# Altium schematic sheet MCU.SchDoc: MCU, IO and RF
size A3; DrawnBy: Randipa G. & Alex S. (8); Organization: UC; Address1: ECE Department; Address2: University of Canterbury; Address3: Christchurch 8041; Address4: New Zealand; DocumentNumber: 1; Revision: 1; SheetNumber: 1; SheetTotal: 2
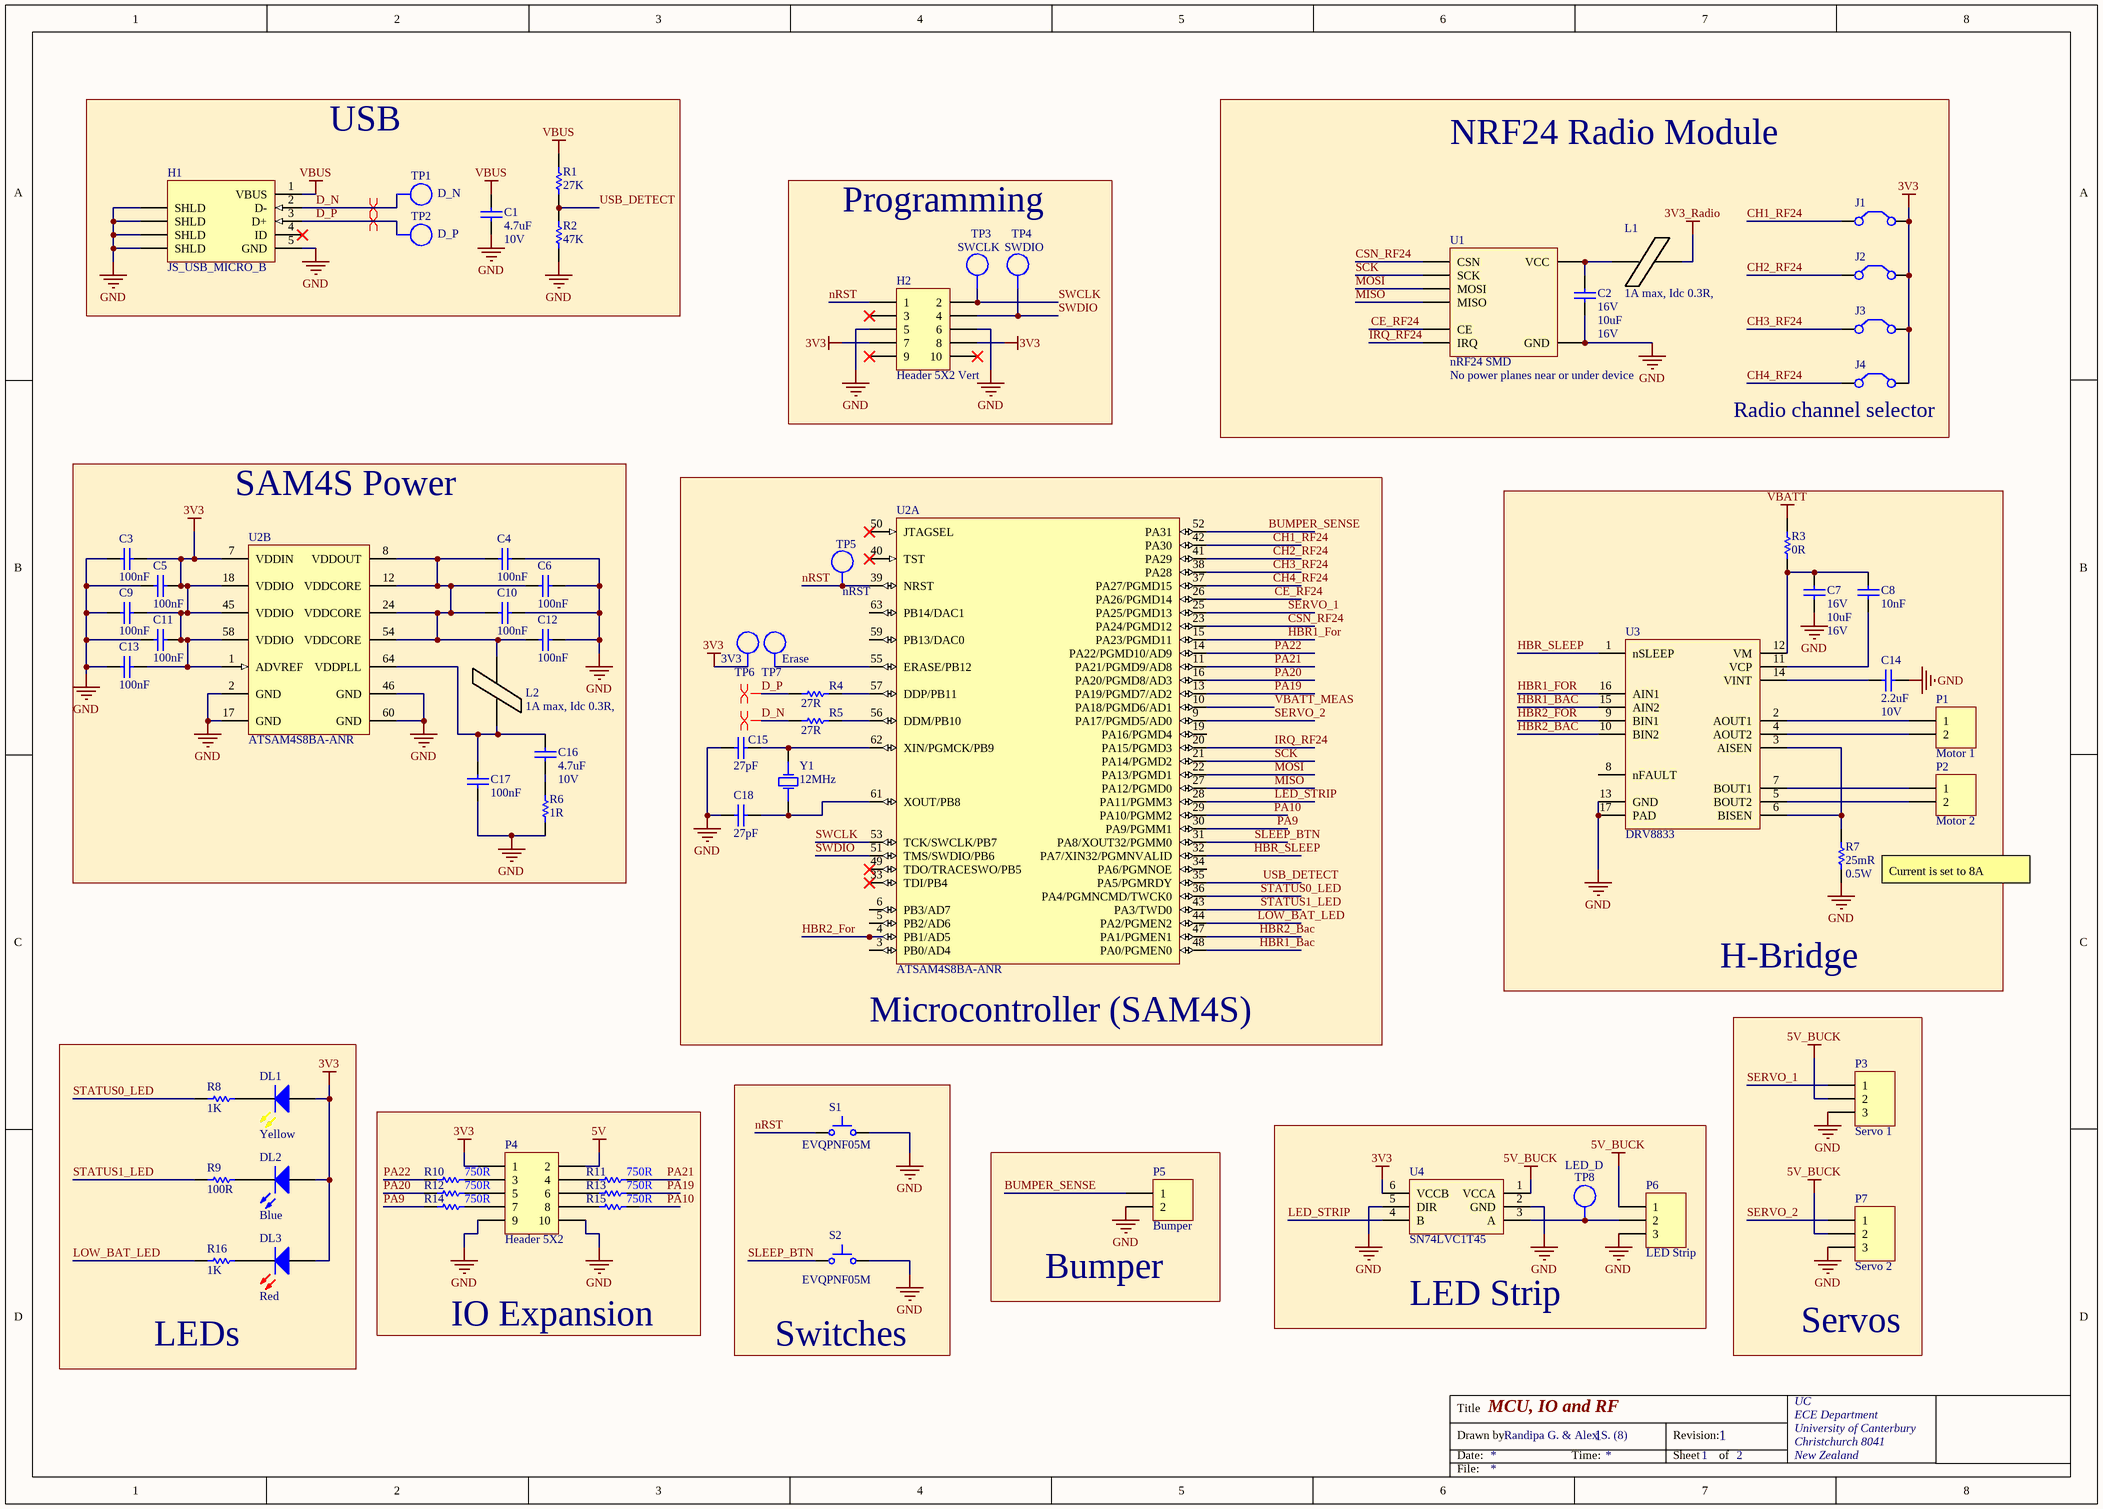
[diagram p0: MCU.SchDoc]

## Parts
C1  Max Voltage: 10V  [CAPC1608N]  (hidden comment: 4.7uF)
C2  Voltage - Rated: 16V  [CAPC2012L]  (hidden comment: 10uF)
C3  100nF  [CAPC1608L]
C4  100nF  [CAPC1608L]
C5  100nF  [CAPC1608L]
C6  100nF  [CAPC1608L]
C7  Voltage - Rated: 16V  [CAPC2012L]  (hidden comment: 10uF)
C8  10nF  [CAPC1608L]
C9  100nF  [CAPC1608L]
C10  100nF  [CAPC1608L]
C11  100nF  [CAPC1608L]
C12  100nF  [CAPC1608L]
C13  100nF  [CAPC1608L]
C14  Max Voltage: 10V  [CAPC1608L]  (hidden comment: 2.2uF)
C15  27pF  [CAPC1608L]
C16  Max Voltage: 10V  [CAPC1608N]  (hidden comment: 4.7uF)
C17  100nF  [CAPC1608L]
C18  27pF  [CAPC1608L]
DL1  Yellow  [WL-SMCW0603]
DL2  Blue  [WL-SMCW0603]
DL3  Red  [WL-SMCW0603]
H1  JS_USB_MICRO_B  [FCI_USB_10118194-0001LF]
H2  Header 5X2 Vert  [IDC2.54-V10D]
J1  100Mil Jumper  [JMP2.54]  (value not drawn)
J2  100Mil Jumper  [JMP2.54]  (value not drawn)
J3  100Mil Jumper  [JMP2.54]  (value not drawn)
J4  100Mil Jumper  [JMP2.54]  (value not drawn)
L1  1A max, Idc 0.3R,  [INDC3216L]
L2  1A max, Idc 0.3R,  [INDC3216L]
P1  Motor 1  [MHDR1X2]
P2  Motor 2  [MHDR1X2]
P3  Servo 1  [MHDR1X3]
P4  Header 5X2  [HDR2X5]
P5  Bumper  [MHDR1X2]
P6  LED Strip  [MHDR1X3]
P7  Servo 2  [MHDR1X3]
R1  27K  [RESC1608L]
R2  47K  [RESC1608L]
R3  0R  [RESC1608L]
R4  27R  [RESC1608L]
R5  27R  [RESC1608L]
R6  1R  [RESC3216L]
R7  25mR  Power: 0.5W  [RESC3216N]
R8  1K  [RESC1608L]
R9  100R  [RESC1608L]
R10  750R  [RESC1608L]
R11  750R  [RESC1608L]
R12  750R  [RESC1608L]
R13  750R  [RESC1608L]
R14  750R  [RESC1608L]
R15  750R  [RESC1608L]
R16  1K  [RESC1608L]
S1  EVQPNF05M  [EVQPNF05M]
S2  EVQPNF05M  [EVQPNF05M]
TP1  D_N  [TP_1206]  (no BOM)
TP2  D_P  [TP_1206]  (no BOM)
TP3  SWCLK  [TP_1206]  (no BOM)
TP4  SWDIO  [TP_1206]  (no BOM)
TP5  nRST  [TP_1206]  (no BOM)
TP6  3V3  [TP_1206]  (no BOM)
TP7  Erase  [TP_1206]  (no BOM)
TP8  LED_D  [TP_1206]  (no BOM)
U1  nRF24 SMD  Warning: No power planes near or under device  [NRF24]
U2  ATSAM4S8BA-ANR  [LQFP64_L]  (parts A,B of 2)
U3  DRV8833  [HTSOP16]
U4  SN74LVC1T45  [SOT23-6_N]
Y1  12MHz  [6.0X3.5-4]

## Blocks framed on the sheet
USB: C1 H1 R1 R2 TP1 TP2
NRF24 Radio Module: C2 J1-J4 L1 U1
Programming: H2 TP3 TP4
SAM4S Power: C3-C6 C9-C13 C16 C17 L2 R6 U2
Microcontroller (SAM4S): C15 C18 R4 R5 TP5-TP7 U2 Y1
H-Bridge: C7 C8 C14 P1 P2 R3 R7 U3
Servos: P3 P7
LEDs: DL1-DL3 R8 R9 R16
Switches: S1 S2
IO Expansion: P4 R10-R15
LED Strip: P6 TP8 U4
Bumper: P5

## Nets
3V3: C3.2 C5.2 C9.2 C11.2 C13.2 DL1.2(A) DL2.2(A) DL3.2(A) H2.7 H2.8 J1.2(C2) J2.2(C2) J3.2(C2) J4.2(C2) P4.1 TP6.1 U2.1(ADVREF) U2.7(VDDIN) U2.18(VDDIO) U2.45(VDDIO) U2.58(VDDIO) U4.6(VCCB)
3V3_Radio: L1.2
5V: P4.2
5V_BUCK: P3.2 P6.1 P7.2 U4.1(VCCA)
GND: C1.1 C2.1 C3.1 C4.2 C5.1 C6.2 C7.1 C9.1 C10.2 C11.1 C12.2 C13.1 C14.2 C15.1 C17.1 C18.1 H1.5(GND) H1.6(SHLD) H2.5 H2.6 P3.3 P4.9 P4.10 P5.2 P6.3 P7.3 R2.1 R6.1 R7.1 S1.2 S2.2 U1.2(GND) U2.2(GND) U2.17(GND) U2.46(GND) U2.60(GND) U3.13(GND) U3.17(PAD) U4.2(GND) U4.5(DIR)
VBATT: R3.1
VBUS: C1.2 H1.1(VBUS) R1.2
BUMPER_SENSE: P5.1 U2.52(PA31)
CE_RF24: U1.3(CE) U2.26(PA26/PGMD14)
CH1_RF24: J1.1(C1) U2.42(PA30)
CH2_RF24: J2.1(C1) U2.41(PA29)
CH3_RF24: J3.1(C1) U2.38(PA28)
CH4_RF24: J4.1(C1) U2.37(PA27/PGMD15)
CSN_RF24: U1.4(CSN) U2.23(PA24/PGMD12)
D_N: H1.2(D-) R5.1 TP1.1
D_P: H1.3(D+) R4.1 TP2.1
HBR1_Bac: U2.48(PA0/PGMEN0) U3.15(AIN2)
HBR1_For: U2.15(PA23/PGMD11) U3.16(AIN1)
HBR2_Bac: U2.47(PA1/PGMEN1) U3.10(BIN2)
HBR2_For: U2.4(PB1/AD5) U3.9(BIN1)
HBR_SLEEP: U2.32(PA7/XIN32/PGMNVALID) U3.1(nSLEEP)
IRQ_RF24: U1.8(IRQ) U2.20(PA15/PGMD3)
LED_STRIP: U2.28(PA11/PGMM3) U4.4(B)
LOW_BAT_LED: R16.1 U2.44(PA2/PGMEN2)
MISO: U1.7(MISO) U2.27(PA12/PGMD0)
MOSI: U1.6(MOSI) U2.22(PA13/PGMD1)
nRST: H2.1 S1.1 TP5.1 U2.39(NRST)
PA9: R14.1 U2.30(PA9/PGMM1)
PA10: R15.2 U2.29(PA10/PGMM2)
PA19: R13.2 U2.13(PA19/PGMD7/AD2)
PA20: R12.1 U2.16(PA20/PGMD8/AD3)
PA21: R11.2 U2.11(PA21/PGMD9/AD8)
PA22: R10.1 U2.14(PA22/PGMD10/AD9)
SCK: U1.5(SCK) U2.21(PA14/PGMD2)
SERVO_1: P3.1 U2.25(PA25/PGMD13)
SERVO_2: P7.1 U2.9(PA17/PGMD5/AD0)
SLEEP_BTN: S2.1 U2.31(PA8/XOUT32/PGMM0)
STATUS0_LED: R8.1 U2.36(PA4/PGMNCMD/TWCK0)
STATUS1_LED: R9.1 U2.43(PA3/TWD0)
SWCLK: H2.2 TP3.1 U2.53(TCK/SWCLK/PB7)
SWDIO: H2.4 TP4.1 U2.51(TMS/SWDIO/PB6)
USB_DETECT: R1.1 R2.2 U2.35(PA5/PGMRDY)
VBATT_MEAS: U2.10(PA18/PGMD6/AD1)
NetC2_2: C2.2 L1.1 U1.1(VCC)
NetC4_1: C4.1 C6.1 C10.1 C12.1 L2.2 U2.8(VDDOUT) U2.12(VDDCORE) U2.24(VDDCORE) U2.54(VDDCORE)
NetC7_2: C7.2 C8.2 R3.2 U3.12(VM)
NetC8_1: C8.1 U3.11(VCP)
NetC14_1: C14.1 U3.14(VINT)
NetC15_2: C15.2 U2.62(XIN/PGMCK/PB9) Y1.3(OSC2)
NetC16_1: C16.1 R6.2
NetC16_2: C16.2 C17.2 L2.1 U2.64(VDDPLL)
NetC18_2: C18.2 U2.61(XOUT/PB8) Y1.1(OSC1)
NetDL1_1: DL1.1(K) R8.2
NetDL2_1: DL2.1(K) R9.2
NetDL3_1: DL3.1(K) R16.2
NetP1_1: P1.1 U3.2(AOUT1)
NetP1_2: P1.2 U3.4(AOUT2)
NetP2_1: P2.1 U3.7(BOUT1)
NetP2_2: P2.2 U3.5(BOUT2)
NetP4_3: P4.3 R10.2
NetP4_4: P4.4 R11.1
NetP4_5: P4.5 R12.2
NetP4_6: P4.6 R13.1
NetP4_7: P4.7 R14.2
NetP4_8: P4.8 R15.1
NetP6_2: P6.2 TP8.1 U4.3(A)
NetR4_2: R4.2 U2.57(DDP/PB11)
NetR5_2: R5.2 U2.56(DDM/PB10)
NetR7_2: R7.2 U3.3(AISEN) U3.6(BISEN)
NetTP7_1: TP7.1 U2.55(ERASE/PB12)

Not connected (* = marked no-connect by the designer): H1 4(ID)*; H2 3* 9* 10*; U2 3(PB0/AD4) 5(PB2/AD6) 6(PB3/AD7) 19(PA16/PGMD4) 33(TDI/PB4)* 34(PA6/PGMNOE) 40(TST)* 49(TDO/TRACESWO/PB5)* 50(JTAGSEL)* 59(PB13/DAC0) 63(PB14/DAC1); U3 8(nFAULT)

## Layout directives
differential pair: D_N, D_P

## Notes on the sheet
- (near J4) Radio channel selector
- (near R6) 0603 Sized R?
- Current is set to 8A
- Title
- Drawn by:
- Date:
- Time:
- Revision:
- Sheet
- of
- File:

## Library data of the parts
C1 C16 = CC_4.7uF_0603: CAP CER 4.7uF X5R +-20%  10V 0603; Note: Footprint corresponds to dimensions for bulk cassette packaging. This case size has tightened tolerances.; PackageReference: 0805; Code_IPC: 2012[0805]; Verify: *; Supplier: ECE Dept; Storage Location: PCB Assembly WS; Value: 4.7uF
C2 C7 = CC_10uF_16V_0805: CAP CER 10uF X5R 16V 0805; Manufacturer: Samsung Electro-Mechanics; Manufacturer Part Number: CL21A106KOQNNWE; Note: Footprint corresponds to dimensions for bulk cassette packaging. This case size has tightened tolerances.; Tolerance: ±10%; Notification: Current market demand for these product types have resulted in fluctuating and extending lead times. Lead times may differ.; PackageReference: 0805; Code_IPC: 2012[0805]; Supplier 1: Digi-Key; RoHS: RoHS Compliant; Category: Capacitors; Stock 1: 20000; Pricing 1: 1=0.35, 10=0.25, 100=0.1178, 500=0.08254, 1000=0.06831 (NZD); Packaging: Cut Tape (CT); Part Status: Active; Temperature Coefficient: X5R; Operating Temperature: -55°C ~ 85°C; Features: -; Ratings: -; Applications: General Purpose; Mounting Type: Surface Mount, MLCC; Package / Case: 0805 (2012 Metric); Size / Dimension: 0.079" L x 0.049" W (2.00mm x 1.25mm); Height - Seated (Max): -; Thickness (Max): 0.055" (1.40mm); Lead Spacing: -; Lead Style: -; ComponentLink1URL: http://www.samsungsem.com/kr/support/product-search/mlcc/CL21A106KOQNNWE.jsp; ComponentLink1Description: http://www.samsungsem.com/kr/support/product-search/mlcc/CL21A106KOQNNWE.jsp; Supplier Part Number 1: 1276-2894-1-ND; Value: 10uF; Max Voltage: 16V
C3-C6 C9-C13 C17 = CC_100nF_0603: CAP CER 100nF X7R +-10% 50V 0603; PackageReference: 0603; Code_IPC: 1608 [0603]; Verify: *; Supplier: ECE Dept; Storage Location: PCB Assembly WS; Value: 100nF
C8 = CC_10nF_0603: CAP CER 10nF X7R +-10% 50V 0603; PackageReference: 0603; Code_IPC: 1608 [0603]; Verify: *; Supplier: ECE Dept; Storage Location: PCB Assembly WS; Value: 10nF
C14 = CC_2.2uF_0603: CAP CER 2.2uF X5R +-20% 10V 0603; PackageReference: 0603; Code_IPC: 1608 [0603]; Verify: *; Supplier: ECE Dept; Storage Location: PCB Assembly WS; Value: 2.2uF
C15 C18 = CC_27pF_0603: CAP CER 27pF NPO/COG +-5% 50V 0603; PackageReference: 0603; Code_IPC: 1608 [0603]; Verify: *; Supplier: ECE Dept; Storage Location: PCB Assembly WS; Value: 27pF
DL1 = DL_150060YS75000: LED Yellow 120mcd 0603 SMD; Manufacturer: WURTH ELEKTRONIK; Forward Current If: 30; Forward Voltage: 2; Wavelength Typ: 590; Lens Shape: Rectangular; Viewing Angle: 140°; Luminous Intensity: 120; LED Mounting: SMD; Supplier 1: Farnell; Supplier Part Number 1: 2322074; Manufacturer Part Number: 150060YS75000; Storage Location: PCB Assembly WS; Supplier: ECE Dept; LED Colour: Yellow
DL2 = DL_150060BS75000: LED Blue 270mcd 0603 SMD; Manufacturer: WURTH ELEKTRONIK; Forward Current If: 30; Forward Voltage: 3.2; Luminous Intensity: 270; Viewing Angle: 120°; Wavelength Typ: 470; Pricing: 1=0.3844, 50=0.3252, 100=0.2957, 500=0.2365 (NZD); Supplier 1: Farnell; Supplier Part Number 1: 2322069; Manufacturer Part Number: 150060BS75000; Storage Location: PCB Assembly WS; Supplier: ECE Dept; LED Colour: Blue
DL3 = DL_150060RS75000: LED Red 250mcd 0603 SMD; Manufacturer: WURTH ELEKTRONIK; Forward Current If: 30; Forward Voltage: 2; Lens Shape: Rectangular; Luminous Intensity: 250; Wavelength Typ: 625; Viewing Angle: 140°; LED Mounting: SMD; Supplier 1: Farnell; Supplier Part Number 1: 2322071; Manufacturer Part Number: 150060RS75000; Storage Location: PCB Assembly WS; Supplier: ECE Dept; LED Colour: Red
H1 = JS_USB_MICRO_B_SMT: CONN USB MICRO B RECPT SMT R/A; Manufacturer: FCI; Manufacturer Part Number: 10118194-0001LF; Gender: Receptacle; Number of Contacts: 5; Specifications: USB 2.0; Supplier 1: Digi-Key; Supplier Part Number 1: 609-4618-1-ND; Features: Shielded, Solder Retention; Mounting Type: Surface Mount, Right Angle, Horizontal
H2 = JA_HDR_IDC_5X2_VERT: IDC Header, 2,54mm, 10-Pin, Vert; Supplier: ECE Dept; Supplier 1: Farnell; Supplier Part Number 1: 1096985; Storage Location: ECE Dept Store
J1-J4 = TP_JUMPER: 2.54mm Jumper Thru Hole; Pitch Spacing: 2.54; No. of Rows: 1; No. of Positions: 2; Supplier: ECE Dept; Supplier 1: Farnell; Supplier Part Number 1: 1097975; Storage Location: ECE$ Store
L1 L2 = IN_Ferrite-Bead: Ferrite Bead, Rdc 0.3R, Z100MHZ 600R, Imax 1A, SMD 1206; Manufacturer: FAIR-RITE; Manufacturer PN: 2512066017Y1; DC Current Rating: 1; DC Resistance Max: 0.08; Ferrite Case Style: 1206 ^3216 Metric]; Frequency Range: 50MHz to 1; Impedance: 600; Impedance Tolerance: ± 25%; Supplier: ECE Dept; Storage Location: PCB Assembly WS; Ferrite Mounting: SMD; Supplier 1: Farnell; Supplier Part Number 1: 1612060; Manufacturer Part Number: 2512066017Y1; Value: 1A max, Idc 0.3R,
P1 P2 P5 = MHDR1X2: Header, 2-Pin; LatestRevisionDate: 17-Jul-2002; LatestRevisionNote: Re-released for DXP Platform.; Publisher: Altium Limited
P3 P6 P7 = MHDR1X3: Header, 3-Pin; LatestRevisionDate: 17-Jul-2002; LatestRevisionNote: Re-released for DXP Platform.; Publisher: Altium Limited
P4 = Header 5X2: Header, 5-Pin, Dual row; LatestRevisionDate: 17-Jul-2002; LatestRevisionNote: Re-released for DXP Platform.; Publisher: Altium Limited
R1 R2 = RS_27K: RES 27K OHM 1/10W 5% 0603 SMD; Storage Location: PCB Assembly WS; Supplier: ECE Dept
  R1: Value: 27K
  R2: Value: 47K
R3 = RS_0R0: RES 0.0 OHM 1/10W 5% 0603 SMD; Storage Location: PCB Assembly WS; Supplier: ECE Dept; Value: 0R
R4 R5 = RS_27R: RES 27 OHM 1/10W 5% 0603 SMD; Storage Location: PCB Assembly WS; Supplier: ECE Dept; Value: 27R
R6 = RT_1R: RES 1R OHM 1/4W 5% 1206 SMD; Storage Location: PCB Assembly WS; Supplier: ECE Dept; Value: 1R
R7 = RS_25mR: 0.5W 1206 25mR Resistor
R8 R16 = RS_1K: RES 1.0K OHM 1/10W 5% 0603 SMD; Storage Location: PCB Assembly WS; Supplier: ECE Dept; Value: 1K
R9 = RS_100R: RES 100 OHM 1/10W 5% 0603 SMD; Storage Location: PCB Assembly WS; Supplier: ECE Dept; Value: 100R
R10-R15 = RS_750R: RES 750 OHM 1/10W 5% 0603 SMD; Storage Location: PCB Assembly WS; Supplier: ECE Dept; Value: 750R
S1 S2 = WS_EVQPNF05M: Panasonic 6 x 3.5mm SMD Light Touch Switch Type SMD; PackageDescription: 6.0 x 3.5 mm; Supplier 1: Farnell; Supplier Part Number 1: 2079481; Manufacturer: Panasonic; Manufacturer PN: EVQPNF05M; Supplier 2: Digi-Key; Supplier Part Number 2: P13598SCT-ND; Storage Location: PCB Assembly WS; Supplier: ECE Dept
TP1-TP8 = TP_1206: Test-Point 3.3x1.6x2.1mm SMD; Manufacturer: Harwin Inc; Manufacturer Part Number: S1751-46R; Value: TP; Manufacturer PN: *; Storage Location: ProtoPlace; Mounting Type: Surface Mount; Type: PC Test Point; Supplier 1: Digi-Key; Supplier Part Number 1: 952-1478-2-ND; Supplier 2: Farnell; Supplier Part Number 2: 1826282; Supplier: ECE Dept
U1 = NRF24: nRF24 SMD Module
U2 = SE_ATSAM4S16BA-MU: IC MCU 32BIT 512KB FLASH 64LQFP; Manufacturer: Atmel; Connectivity: I²C, IrDA, Memory Card, SPI, SSC, UART/USART, USB; Core Processor: ARM® Cortex®-M4; Core Size: 32-Bit; Data Converters: A/D 11x12b, D/A 2x12b; Number of I/O: 47; Peripherals: Brown-out Detect/Reset, DMA, POR, PWM, WDT; Program Memory Size: 512KB (512K x 8); RAM Size: 128K x 8; Speed: 120MHz; Voltage - Supply (Vcc/Vdd): 1.62 V ~ 3.6 V; PackageVersion: revJ, Jul-2007; PackageReference: 64PS; PackageDescription: 64-Pin Quad Flat No-Lead (QFN) Sawn, 9 x 9 x 1.0 mm Body, 0.5 mm Pitch, Exposed Pad; Code_JEDEC: MO-220VMMD-3; ComponentLink1Description: Manufacturer URL; ComponentLink1URL: http://www.atmel.com/; ComponentLink2Description: SAM4S Series Datasheet; ComponentLink2URL: http://www.atmel.com/dyn/resources/prod_documents/11100.pdf; ComponentLink3Description: SAM4S Series Summary; ComponentLink3URL: http://www.atmel.com/dyn/resources/prod_documents/11100S.pdf; Supplier 1: Digi-Key; Package / Case: 64-LQFP; Packaging: Cut Tape (CT); Program Memory Type: FLASH; Supplier Part Number 1: ATSAM4S8BA-ANRCT-ND; Manufacturer Part Number: ATSAM4S8BA-ANR
U3 = DRV8833: Dual H-Bridge Motor Driver 1.5A
U4 = SN74LVC1T45: 1.8V - 5V level converter
Y1 = XT_CRYSTAL_12MHz_18pF: CRYSTAL 12MHZ 18PF 6X3.5mm SMD; Manufacturer: CTS-Frequency Controls; Manufacturer Part Number: 406C35D12M00000; ESR (Equivalent Series Resistance): 60 Ohm; Frequency Stability: ±50ppm; Frequency Tolerance: ±30ppm; Operating Mode: Fundamental; Supplier 1: Digi-Key; Height: 0.047" (1.20mm); Load Capacitance: 18pF; Mounting Type: Surface Mount; Operating Temperature: -20°C ~ 70°C; Package / Case: 4-SMD, No Lead (DFN, LCC); Size / Dimension: 0.236" L x 0.138" W (6.00mm x 3.50mm); Supplier Part Number 1: CTX855CT-ND; Frequency: 12MHz